# EAGLE design ENC28j60BO (EAGLE 8.1.0)
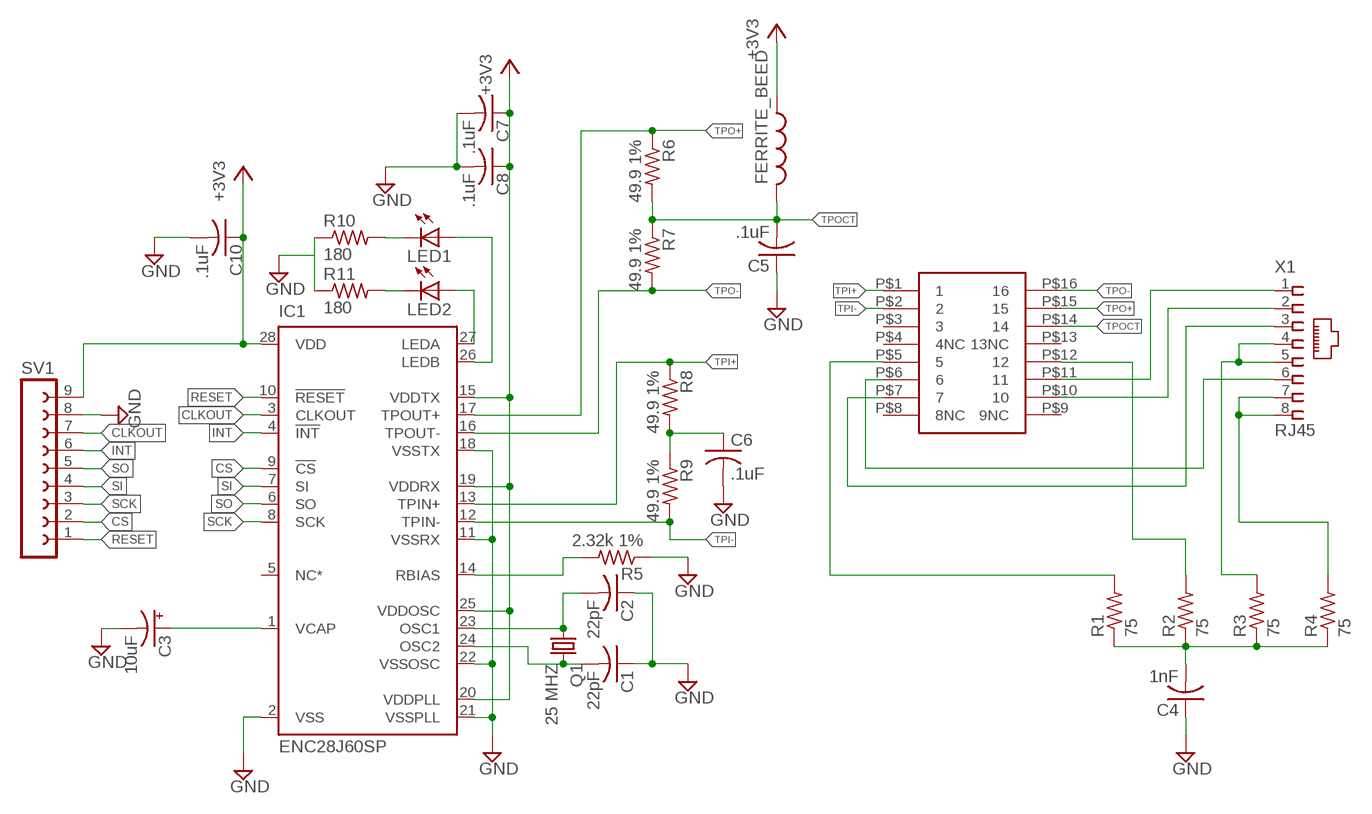
[diagram p0: schematic, sheet 1]

## Parts
C1  22pF  C-US025-024X044  [C025-024X044]
C2  22pF  C-US025-024X044  [C025-024X044]
C3  10uF  CPOL-USE2,5-6E  [E2,5-6E]
C4  1nF  C-US050-025X075  [C050-025X075]
C5  .1uF  C-US050-024X044  [C050-024X044]
C6  .1uF  C-US050-024X044  [C050-024X044]
C7  .1uF  C-US050-024X044  [C050-024X044]
C8  .1uF  C-US050-024X044  [C050-024X044]
C10  .1uF  C-US050-024X044  [C050-024X044]
FERRITE_BEED  L-US0204/7  [0204/7]
IC1  ENC28J60SP  [DIL28-3]
LED1  LED3MM  [LED3MM]
LED2  LED3MM  [LED3MM]
Q1  25 MHZ  CRYSTALHC49U-V  [HC49U-V]
R1  75  R-US_0204/7  [0204/7]
R2  75  R-US_0204/7  [0204/7]
R3  75  R-US_0204/7  [0204/7]
R4  75  R-US_0204/7  [0204/7]
R5  2.32k 1%  R-US_0204/7  [0204/7]
R6  49.9 1%  R-US_0204/7  [0204/7]
R7  49.9 1%  R-US_0204/7  [0204/7]
R8  49.9 1%  R-US_0204/7  [0204/7]
R9  49.9 1%  R-US_0204/7  [0204/7]
R10  180  R-US_0204/7  [0204/7]
R11  180  R-US_0204/7  [0204/7]
SV1  FE09-1  [FE09]
U$1  S558-5999-46-F  [DIP16SMD]
X1  RJ45  [RJ45]

## Nets
+3V3: C7.1 C8.1 C10.1 FERRITE_BEED.1 IC1.15(VDDTX) IC1.19(VDDRX) IC1.20(VDDPLL) IC1.25(VDDOSC) IC1.28(VDD) SV1.9
CLKOUT: IC1.3(CLKOUT) SV1.7
CS: IC1.9(!CS) SV1.2
GND: C1.1 C2.1 C3.- C4.1 C5.1 C6.2 C7.2 C8.2 C10.2 IC1.2(VSS) IC1.11(VSSRX) IC1.18(VSSTX) IC1.21(VSSPLL) IC1.22(VSSOSC) R5.1 R10.1 R11.1 SV1.8
INT: IC1.4(!INT) SV1.6
N$1: C2.2 IC1.23(OSC1) Q1.1
N$2: C1.2 IC1.24(OSC2) Q1.2
N$3: C3.+ IC1.1(VCAP)
N$4: IC1.27(LEDA) LED2.A
N$5: U$1.P$10 X1.2
N$6: U$1.P$7 X1.3
N$7: U$1.P$6 X1.6
N$8: U$1.P$11 X1.1
N$9: R3.2 X1.4 X1.5
N$10: R4.2 X1.7 X1.8
N$11: C4.2 R1.1 R2.1 R3.1 R4.1
N$12: IC1.26(LEDB) LED1.A
N$13: R2.2 U$1.P$12
N$14: R1.2 U$1.P$5
N$15: IC1.14(RBIAS) R5.2
N$16: C6.1 R8.2 R9.1
N$19: LED1.K(C) R10.2
N$20: LED2.K(C) R11.2
RESET: IC1.10(!RESET) SV1.1
SCK: IC1.8(SCK) SV1.3
SI: IC1.7(SI) SV1.4
SO: IC1.6(SO) SV1.5
TPI+: IC1.13(TPIN+) R8.1 U$1.P$1
TPI-: IC1.12(TPIN-) R9.2 U$1.P$2
TPO+: IC1.17(TPOUT+) R6.1 U$1.P$15
TPO-: IC1.16(TPOUT-) R7.2 U$1.P$16
TPOCT: C5.2 FERRITE_BEED.2 R6.2 R7.1 U$1.P$14
Unconnected: IC1.5(NC*) U$1.P$3 U$1.P$4(4NC) U$1.P$8(8NC) U$1.P$9(9NC) U$1.P$13(13NC)

## Library data of the parts
C1 C2 C4-C8 C10 = rcl:C-US: CAPACITOR, American symbol
C3 = rcl:CPOL-US: POLARIZED CAPACITOR, American symbol
FERRITE_BEED = rcl:L-US: INDUCTOR, American symbol
IC1 = microchip:ENC28J60: Stand-Alone Ethernet Controller with SPI Interface Source: http://ww1.microchip.com/downloads/en/DeviceDoc/39662c.pdf; MF: MICROCHIP; MPN: ENC28J60/SP; OC_FARNELL: 1084619; OC_NEWARK: 96K3661
LED1 LED2 = led:LED: LED OSRAM: - CHIPLED LG R971, LG N971, LY N971, LG Q971, LY Q971, LO R971, LY R971 LH N974, LH R974 LS Q976, LO Q976, LY Q976 LO Q996 - Hyper CHIPLED LW Q18S LB Q993, LB Q99A, LB R99A - SideLED LS A670, LO A670, LY A670, LG A670, LP A670 LB A673, LV A673, LT A673, LW A673 LH A674 LY A675 LS A676, LA A676, LO A676, LY A676, LW A676 LS A679, LY A679, LG A679 - Hyper Micro SIDELED® LS Y876, LA Y876, LO Y876, LY Y876 LT Y87S - SmartLED LW L88C, LW L88S LB L89C, LB L89S, LG L890 LS L89K, LO L89K, LY L89K LS L896, LA L896, LO L896, LY L896 - TOPLED LS T670, LO T670, LY T670, LG T670, LP T670 LSG T670, LSP T670, LSY T670, LOP T670, LYG T670 LG T671, LOG T671, LSG T671 LB T673, LV T673, LT T673, LW T673 LH T674 LS T676, LA T676, LO T676, LY T676, LB T676, LH T676, LSB T676, LW T676 LB T67C, LV T67C, LT T67C, LS T67K, LO T67K, LY T67K, LW E67C LS E67B, LA E67B, LO E67B, LY E67B, LB E67C, LV E67C, LT E67C LW T67C LS T679, LY T679, LG T679 LS T770, LO T770, LY T770, LG T770, LP T770 LB T773, LV T773, LT T773, LW T773 LH T774 LS E675, LA E675, LY E675, LS T675 LS T776, LA T776, LO T776, LY T776, LB T776 LHGB T686 LT T68C, LB T68C - Hyper Mini TOPLED® LB M676 - Mini TOPLED Santana® LG M470 LS M47K, LO M47K, LY M47K Source: http://www.osram.convergy.de LUXEON: - LUMILED® LXK2-PW12-R00, LXK2-PW12-S00, LXK2-PW14-U00, LXK2-PW14-V00 LXK2-PM12-R00, LXK2-PM12-S00, LXK2-PM14-U00 LXK2-PE12-Q00, LXK2-PE12-R00, LXK2-PE12-S00, LXK2-PE14-T00, LXK2-PE14-U00 LXK2-PB12-K00, LXK2-PB12-L00, LXK2-PB12-M00, LXK2-PB14-N00, LXK2-PB14-P00, LXK2-PB14-Q00 LXK2-PR12-L00, LXK2-PR12-M00, LXK2-PR14-Q00, LXK2-PR14-R00 LXK2-PD12-Q00, LXK2-PD12-R00, LXK2-PD12-S00 LXK2-PH12-R00, LXK2-PH12-S00 LXK2-PL12-P00, LXK2-PL12-Q00, LXK2-PL12-R00 Source: www.luxeon.com KINGBRIGHT: KA-3528ASYC Source: www.kingbright.com
Q1 = crystal:CRYSTAL: CRYSTAL; OC_FARNELL: 1666969; OC_NEWARK: unknown
R1-R11 = rcl:R-US_: RESISTOR, American symbol
SV1 = con-lsta:FE09-1: FEMALE HEADER; OC_FARNELL: unknown; OC_NEWARK: unknown
U$1 = myLib:S558-5999-46-F
X1 = myLib:RJ45

## Board
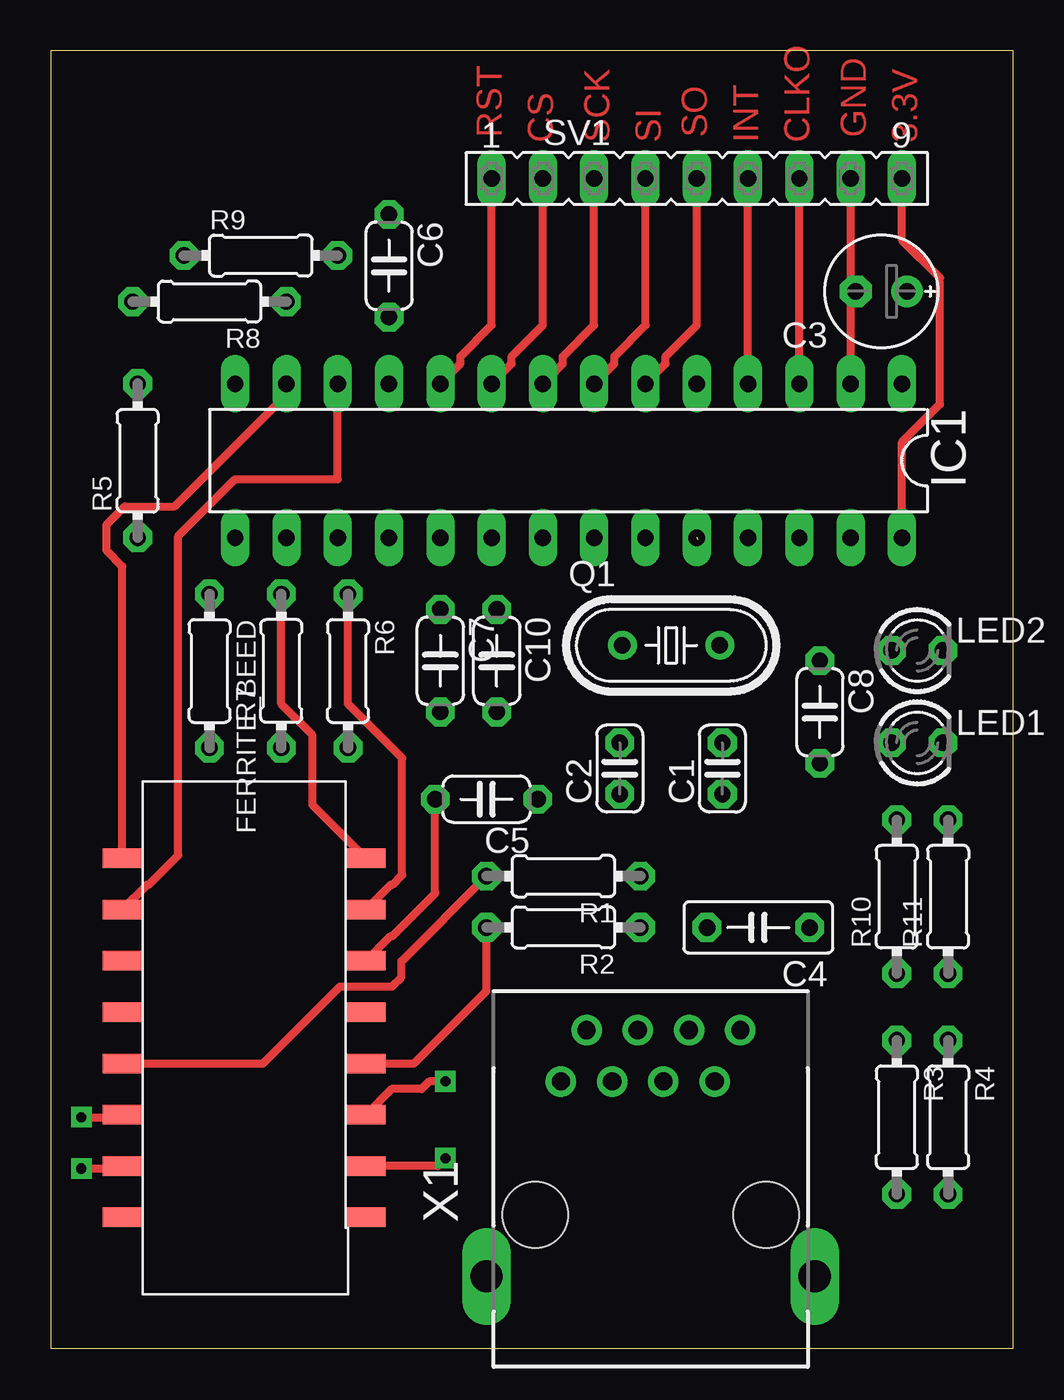
[diagram p1: board, top side]
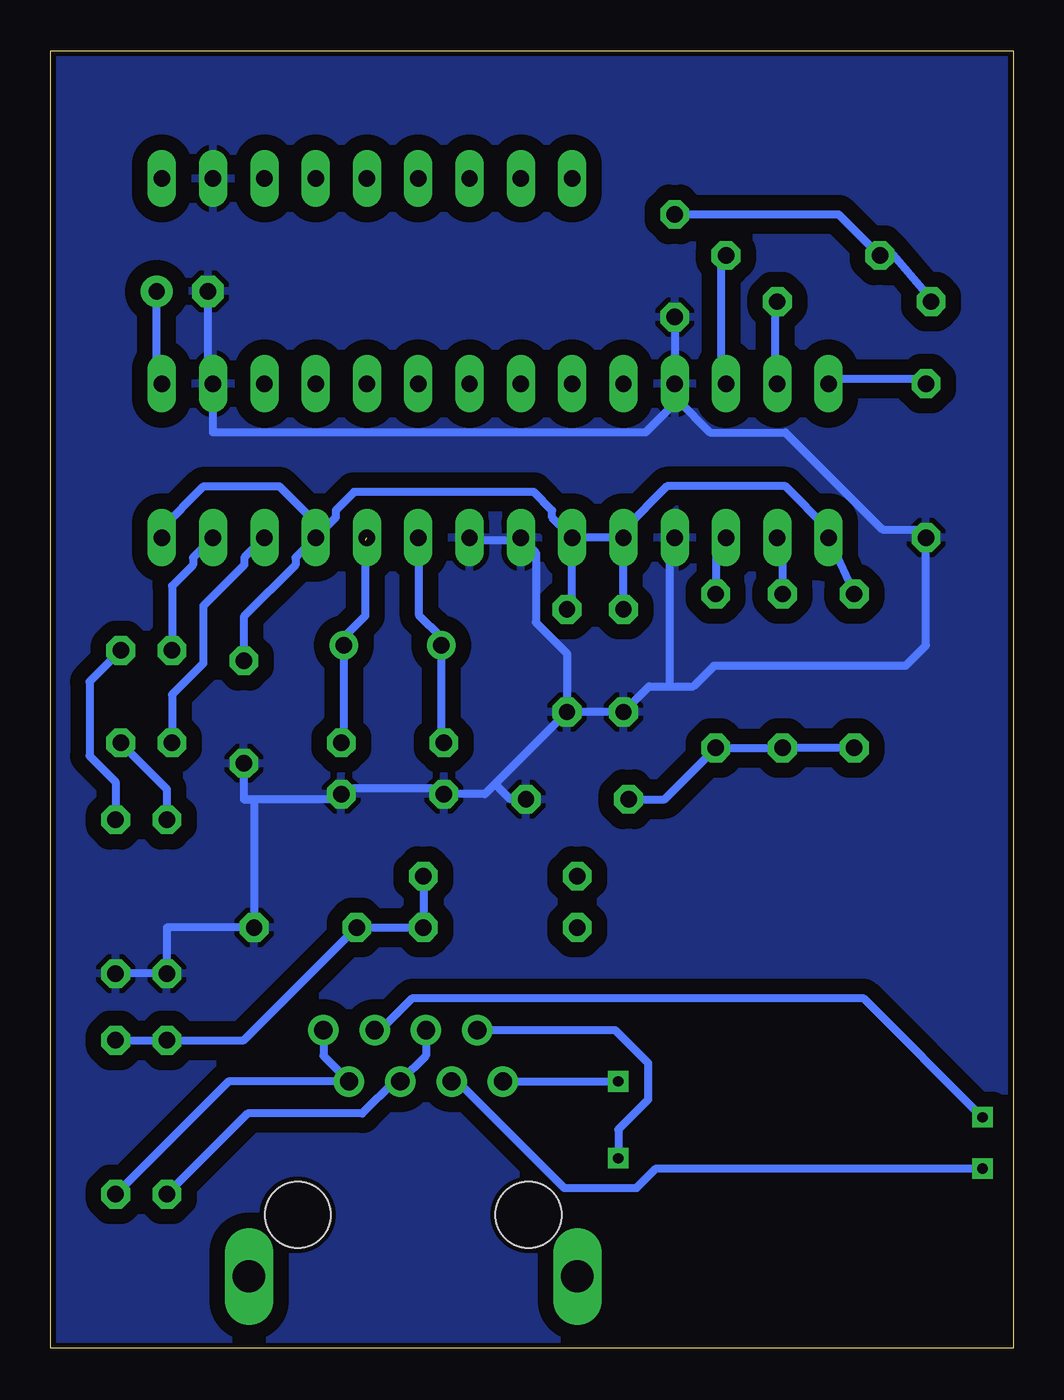
[diagram p2: board, bottom side, seen from below]

Size 47.68 x 64.25 mm. Coordinates in mm from the lower left corner, seen from the top.
Outline: 0,0 47.68,0 47.68,64.25 0,64.25 0,0
Copper layers (1*16): Top 0.035mm / dielectric 1.5mm / Bottom 0.035mm
Design rules "SparkFun *": minimum track width 0.4mm, minimum drill 20mil, track to track 30mil, track to pad 25mil, pad to pad 8mil, via to via 8mil, smd to smd 8mil, copper to edge 10mil, drill to drill 20mil, minimum pad ring 12mil, minimum via ring 10mil, stop-mask expansion 4mil, vias tented up to drill 25mil, thermal gap 10mil

### Footprints (pad centres in the part's own frame; a part is rotated, then mirrored left to right if it is on the bottom)
C025-024X044 = drill 0.813 octagon: 1 -1.27,0; 2 1.27,0
E2,5-6E = drill 0.813 pad 1.575: + -1.27,0 | drill 0.813 pad 1.575 octagon: - 1.27,0
C050-025X075 = drill 0.813 octagon: 1 -2.54,0; 2 2.54,0
C050-024X044 = drill 0.813 octagon: 1 -2.54,0; 2 2.54,0
0204/7 = drill 0.813 octagon: 1 -3.81,0; 2 3.81,0
DIL28-3 = drill 0.813 long: 1 -16.51,-3.81; 2 -13.97,-3.81; 3 -11.43,-3.81; 4 -8.89,-3.81; 5 -6.35,-3.81; 6 -3.81,-3.81; 7 -1.27,-3.81; 8 1.27,-3.81; 9 3.81,-3.81; 10 6.35,-3.81; 11 8.89,-3.81; 12 11.43,-3.81; 13 13.97,-3.81; 14 16.51,-3.81; 15 16.51,3.81; 16 13.97,3.81; 17 11.43,3.81; 18 8.89,3.81; 19 6.35,3.81; 20 3.81,3.81; 21 1.27,3.81; 22 -1.27,3.81; 23 -3.81,3.81; 24 -6.35,3.81; 25 -8.89,3.81; 26 -11.43,3.81; 27 -13.97,3.81; 28 -16.51,3.81
LED3MM = drill 0.813 octagon: A -1.27,0; K 1.27,0
HC49U-V = drill 0.813: 1 -2.413,0; 2 2.413,0
FE09 = drill 0.813 long: 1 -10.16,0; 2 -7.62,0; 3 -5.08,0; 4 -2.54,0; 5 0,0; 6 2.54,0; 7 5.08,0; 8 7.62,0; 9 10.16,0
DIP16SMD = smd 1.93 x 0.965: P$1 -5.334,8.509; P$2 -5.334,5.969; P$3 -5.334,3.429; P$4 -5.334,0.889; P$5 -5.334,-1.651; P$6 -5.334,-4.191; P$7 -5.334,-6.731; P$8 -5.334,-9.271; P$9 6.731,-9.271; P$10 6.731,-6.731; P$11 6.731,-4.191; P$12 6.731,-1.651; P$13 6.731,0.889; P$14 6.731,3.429; P$15 6.731,5.969; P$16 6.731,8.509
RJ45 = drill 0.9 pad 1.4: 1 -4.445,5.08; 2 -3.175,7.62; 3 -1.905,5.08; 4 -0.635,7.62; 5 0.635,5.08; 6 1.905,7.62; 7 3.175,5.08; 8 4.445,7.62 | drill 1.6 pad 2.184 long: S1 -8.128,-4.572; S2 8.128,-4.572 | hole 3.251: -5.715,-1.524; 5.715,-1.524

### Placement (x,y rotation side)
C1  33.27,28.7 90 top
C2  28.19,28.7 90 top
C3  41.15,52.32 180 top
C4  35.05,20.83 180 top
C5  21.59,27.18 180 top
C6  16.76,53.59 270 top
C7  19.3,34.04 270 top
C8  38.1,31.5 270 top
C10  22.1,34.04 270 top
FERRITE_BEED  7.87,33.53 270 top
IC1  25.65,43.94 180 top
LED1  42.93,29.97 0 top
LED2  42.93,34.54 0 top
Q1  30.73,34.8 0 top
R1  25.4,23.37 180 top
R2  25.4,20.83 180 top
R3  41.91,11.43 270 top
R4  44.45,11.43 270 top
R5  4.32,43.94 90 top
R6  14.73,33.53 270 top
R7  11.43,33.53 90 top
R8  7.87,51.82 180 top
R9  10.41,54.1 0 top
R10  41.91,22.35 90 top
R11  44.45,22.35 90 top
SV1  32,57.91 0 top
U$1  8.89,15.75 0 top
X1  29.72,8.13 0 top

### Tracks (layer width: path | path; a pad name or v marks a point on that pad's centre or on a via)
+3V3
  Top 0.4: IC1.28 42.16,44.85 44.04,46.73 44.04,53 42.16,54.87 SV1.9
  Bottom 0.4: C8.1 38.1,36.22 35.54,38.78 35.54,39.14 IC1.25 33.55,41.13 33.55,41.48 32.64,42.39 23.74,42.39 22.84,41.48 22.84,41.13 IC1.20 | C10.1 21.84,36.58 IC1.20 | IC1.19 IC1.20
  Bottom 0.406: FERRITE_BEED.1 IC1.15 9.14,40.54 11.28,42.67 17.14,42.67 19.28,40.54 IC1.19 C7.1 | 34.75,41.07 34.75,40.54 IC1.25 34.75,41.07 | 34.75,41.07 36.35,42.67 40.08,42.67 42.22,40.54 IC1.28
CLKOUT
  Top 0.4: IC1.3 SV1.7
CS
  Top 0.4: IC1.9 22.84,48.75 22.84,49.1 24.38,50.65 SV1.2
GND
  Top 0.4: IC1.2 SV1.8
  Bottom 0.4: C10.2 22.1,34.39 23.64,35.94 23.64,39.39 IC1.21 | C3.- 39.88,47.75 IC1.2 39.62,45.34 37.95,45.34 | R11.1 R10.1 41.91,20.83 C4.1 37.59,27.18 38.1,27.18
  Bottom 0.406: IC1.22 26.75,40.01 24.61,40.01 IC1.21 24.08,40.01 | 16.61,46.94 17.14,47.47 IC1.11 | 16.61,46.94 15.01,45.34 11.28,45.34 6.48,40.54 4.34,40.54 R5.1 4.32,34.8 5.33,33.78 14.83,33.78 15.85,32.77 17.02,32.77 | 37.95,45.34 18.21,45.34 16.61,46.94 | 16.61,46.94 IC1.11 | C6.2 IC1.11 | IC1.18 17.02,39.88 17.02,32.77 | 17.02,32.77 18.03,32.77 C7.2 C10.2 25.65,27.94 | 25.65,27.94 26.16,27.43 C2.1 28.35,27.74 33.15,27.74 C1.1 33.53,27.18 38.1,27.18 C8.2 | C5.1 24.89,27.18 25.65,27.94
  pour Bottom: 0,0 0,64.26 47.75,64.26 47.75,0
INT
  Top 0.4: IC1.4 SV1.6
N$1
  Bottom 0.406: C2.2 28.35,30.4 28.35,34.67 Q1.1 28.35,35.2 29.41,36.27 29.41,40.01 IC1.23
N$2  (1 unrouted)
  Bottom 0.406: C1.2 33.15,30.4 Q1.2 33.15,35.2 32.08,36.27 32.08,40.01
N$3
  Bottom 0.4: IC1.1 42.42,47.75 C3.+
N$4
  Bottom 0.4: IC1.27 40.62,39.14 40.62,38.78 41.66,37.74 LED2.A
N$5  (via drill 0.51)
  Top 0.4: 15.62,8.89 U$1.P$10 19.18,9.02 v19.56,9.4
  Bottom 0.4: v19.56,9.4 19.56,10.83 18.09,12.3 18.09,14.11 19.72,15.75 X1.2
N$6  (via drill 0.51)
  Top 0.4: 3.56,8.89 U$1.P$7 3.43,8.89 v1.52,8.89
  Bottom 0.4: X1.3 27.52,13.21 22.24,7.93 18.65,7.93 17.69,8.89 v1.52,8.89
N$7  (via drill 0.51)
  Top 0.4: 3.56,11.68 U$1.P$6 3.43,11.43 v1.52,11.43
  Bottom 0.4: X1.6 31.33,15.75 29.74,17.34 7.43,17.34 v1.52,11.43
N$8  (via drill 0.51)
  Top 0.4: 15.62,11.43 U$1.P$11 16.89,12.83 18.38,12.83 18.76,13.21 v19.56,13.21
  Bottom 0.406: X1.1 v19.56,13.21
N$9
  Bottom 0.4: X1.4 29.08,14.48 X1.5 30.64,13.21 32.23,11.62 37.91,11.62 R3.2
N$10
  Bottom 0.4: X1.8 34.16,14.48 X1.7 38.86,13.21 R4.2
N$11
  Bottom 0.4: R4.1 R3.1 38.1,15.24 C4.2
  Bottom 0.406: R1.1 R2.1 C4.2
N$12
  Bottom 0.4: IC1.26 38.08,39.14 38.08,38.78 40.11,36.75 40.11,33.9 41.66,32.36 LED1.A
N$13
  Top 0.4: U$1.P$12 18,14.1 21.59,17.68 R2.2
N$14
  Top 0.4: U$1.P$5 10.52,14.1 14.33,17.91 16.91,17.91 17.37,18.37 17.37,19.15 R1.2
N$15
  Bottom 0.406: R5.2 4.34,48.01 9.14,48.01 IC1.14
N$16
  Bottom 0.406: R8.2 4.34,52.27 5.97,54.15 R9.1 | 7.01,54.41 R9.1 | R9.1 8.64,56.13 C6.1
N$19
  Bottom 0.4: LED1.K 41.91,27.69 R10.2
N$20
  Bottom 0.4: R11.2 44.45,28.04 45.74,29.33 45.74,33 LED2.K
RESET
  Top 0.4: IC1.10 20.3,48.75 20.3,49.1 21.84,50.65 SV1.1
SCK
  Top 0.4: IC1.8 25.38,48.75 25.38,49.1 26.92,50.65 SV1.3
SI
  Top 0.4: IC1.7 27.92,48.75 27.92,49.1 29.46,50.65 SV1.4
SO
  Top 0.4: IC1.6 30.46,48.75 30.46,49.1 32,50.65 SV1.5
TPI+
  Top 0.4: IC1.13 11.68,47.21 6.15,41.68 3.68,41.68 2.77,40.77 2.77,39.49 3.56,38.71 U$1.P$1
  Bottom 0.406: IC1.13 11.81,48.01 11.81,51.74 R8.1
TPI-
  Top 0.4: U$1.P$2 4.78,22.94 4.87,22.94 6.33,24.4 6.33,40.21 9.14,43.03 14.22,43.03 IC1.12
  Bottom 0.406: IC1.12 14.48,48.01 14.48,53.87 R9.2
TPO+
  Top 0.4: R6.1 14.73,31.91 17.42,29.21 17.42,23.43 16.93,22.94 16.84,22.94 U$1.P$15
  Bottom 0.406: IC1.17 14.73,39.62 R6.1
TPO-
  Top 0.4: U$1.P$16 12.98,26.9 12.98,30.36 11.43,31.91 R7.2
  Bottom 0.406: IC1.16 11.43,39.88 R7.2
TPOCT
  Top 0.4: U$1.P$14 16.84,20.4 16.93,20.4 19.05,22.52 C5.2
  Bottom 0.406: FERRITE_BEED.2 R7.1 R6.2 17.27,27.18 C5.2

### Text on the board
Top: RST | CS | SCK | SI | SO | INT | CLKO | GND | 3.3V